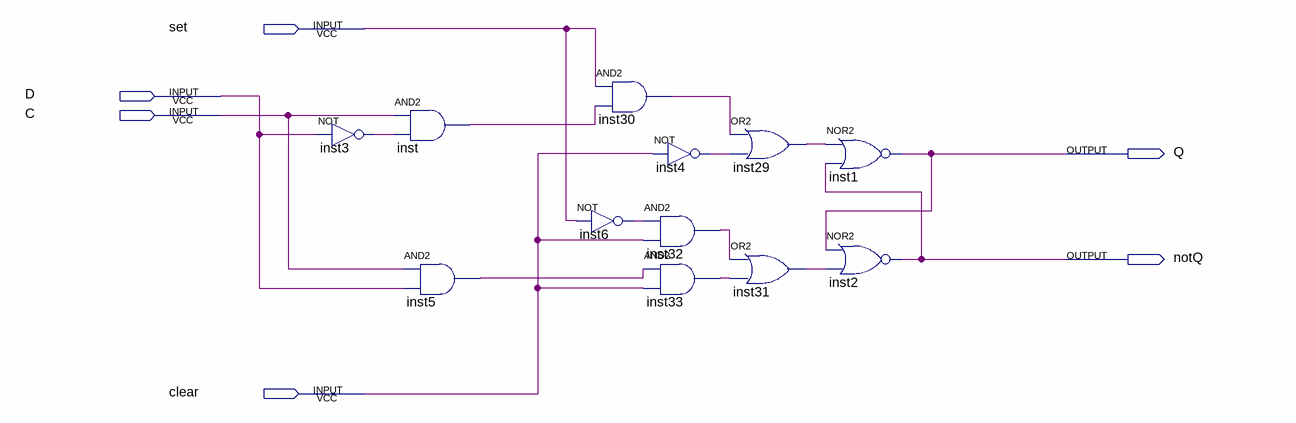
[diagram p0: schematic sheet]
// Quartus schematic D-tr_static.bdf as structural Verilog: 12 symbols, 6 pins
module \D-tr_static  (
  input  set,
  input  D,
  input  C,
  input  clear,
  output Q,
  output notQ
);

  wire inst3_out, inst4_out, inst5_out, inst6_out, inst29_out, inst30_out, inst31_out, inst32_out,
       inst33_out, inst_out;

  not inst3 (inst3_out, D);
  and inst (inst_out, C, inst3_out);
  and inst5 (inst5_out, C, D);
  not inst6 (inst6_out, set);
  and inst30 (inst30_out, set, inst_out);
  not inst4 (inst4_out, clear);
  and inst32 (inst32_out, inst6_out, clear);
  and inst33 (inst33_out, inst5_out, clear);
  or inst29 (inst29_out, inst30_out, inst4_out);
  or inst31 (inst31_out, inst32_out, inst33_out);
  nor inst1 (Q, inst29_out, notQ);
  nor inst2 (notQ, Q, inst31_out);
endmodule
